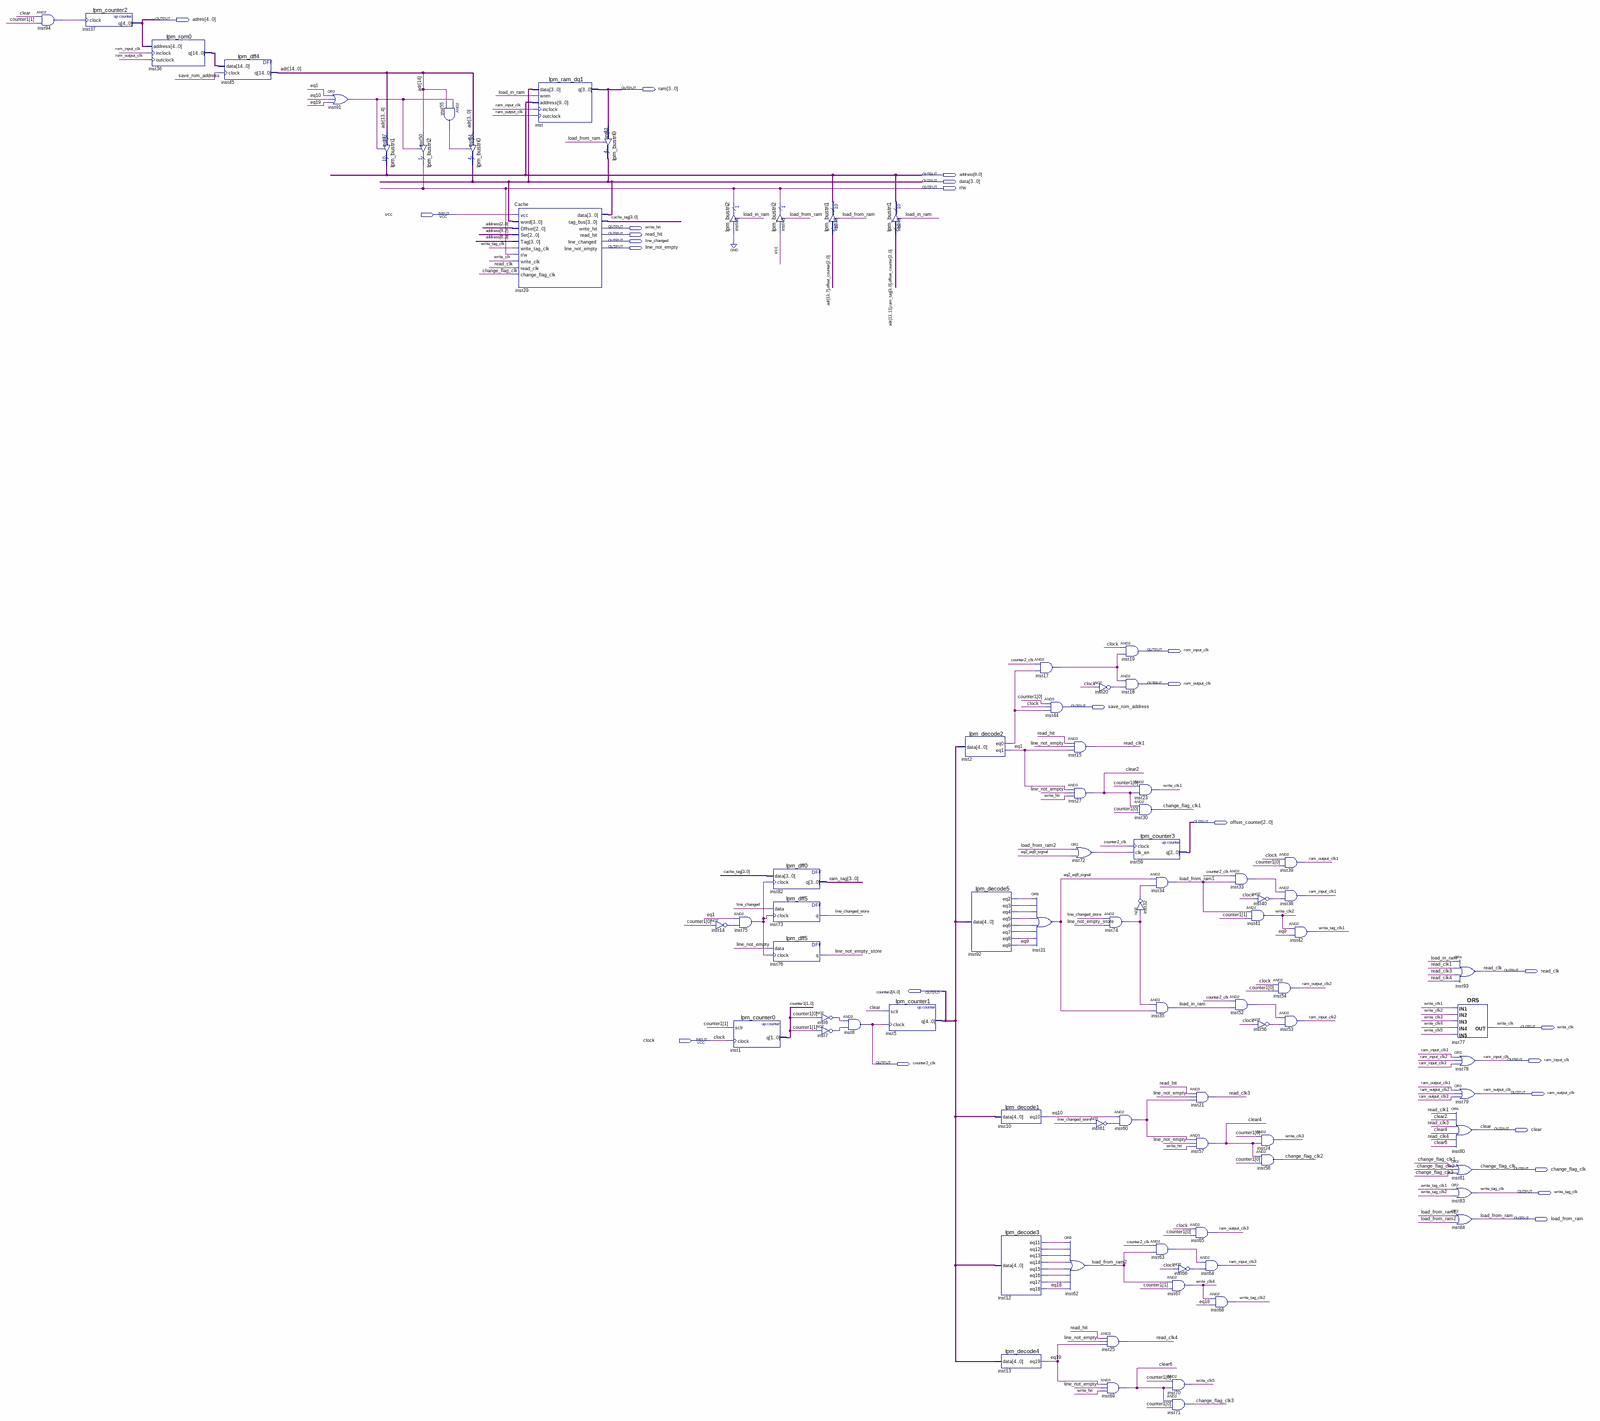
[diagram p0: schematic sheet, whole]
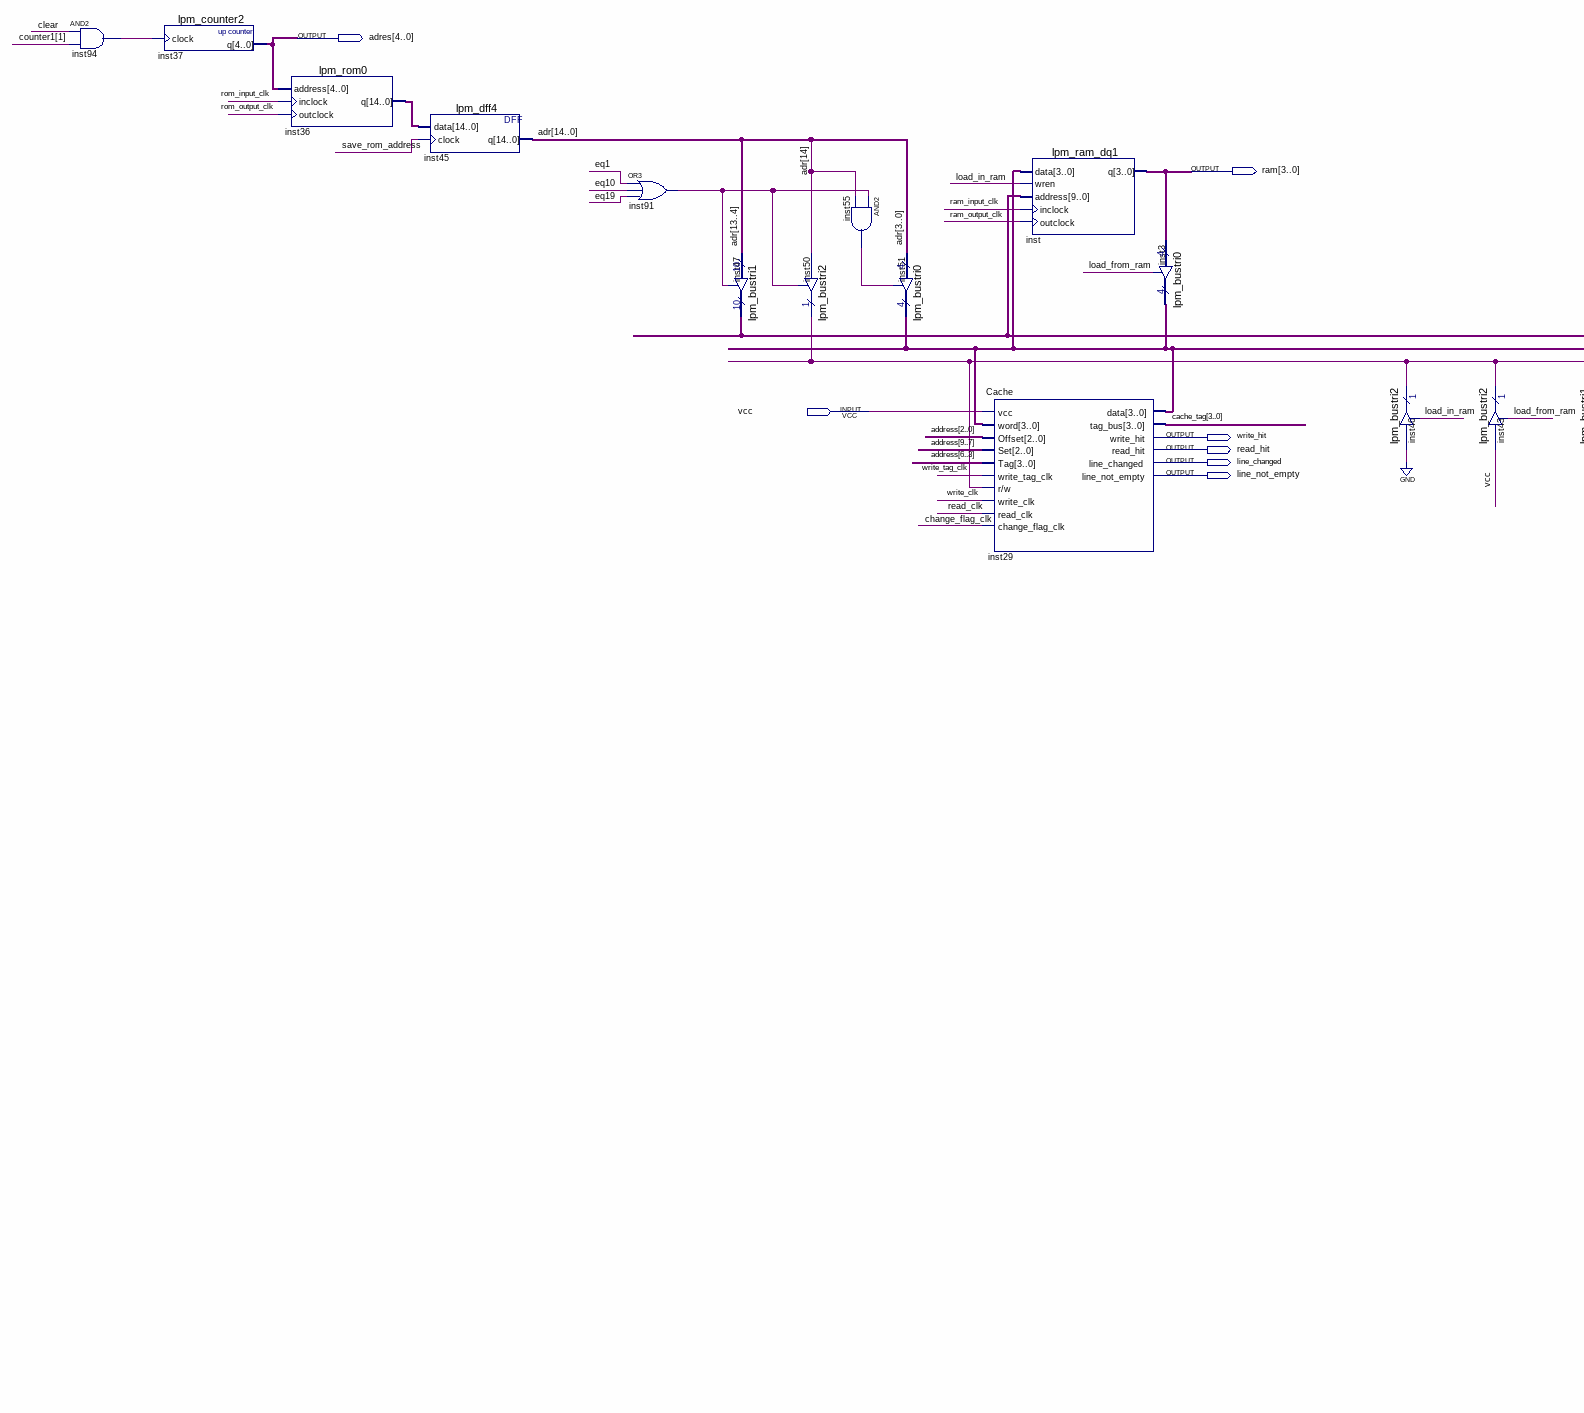
[diagram p1: schematic sheet, upper left part]
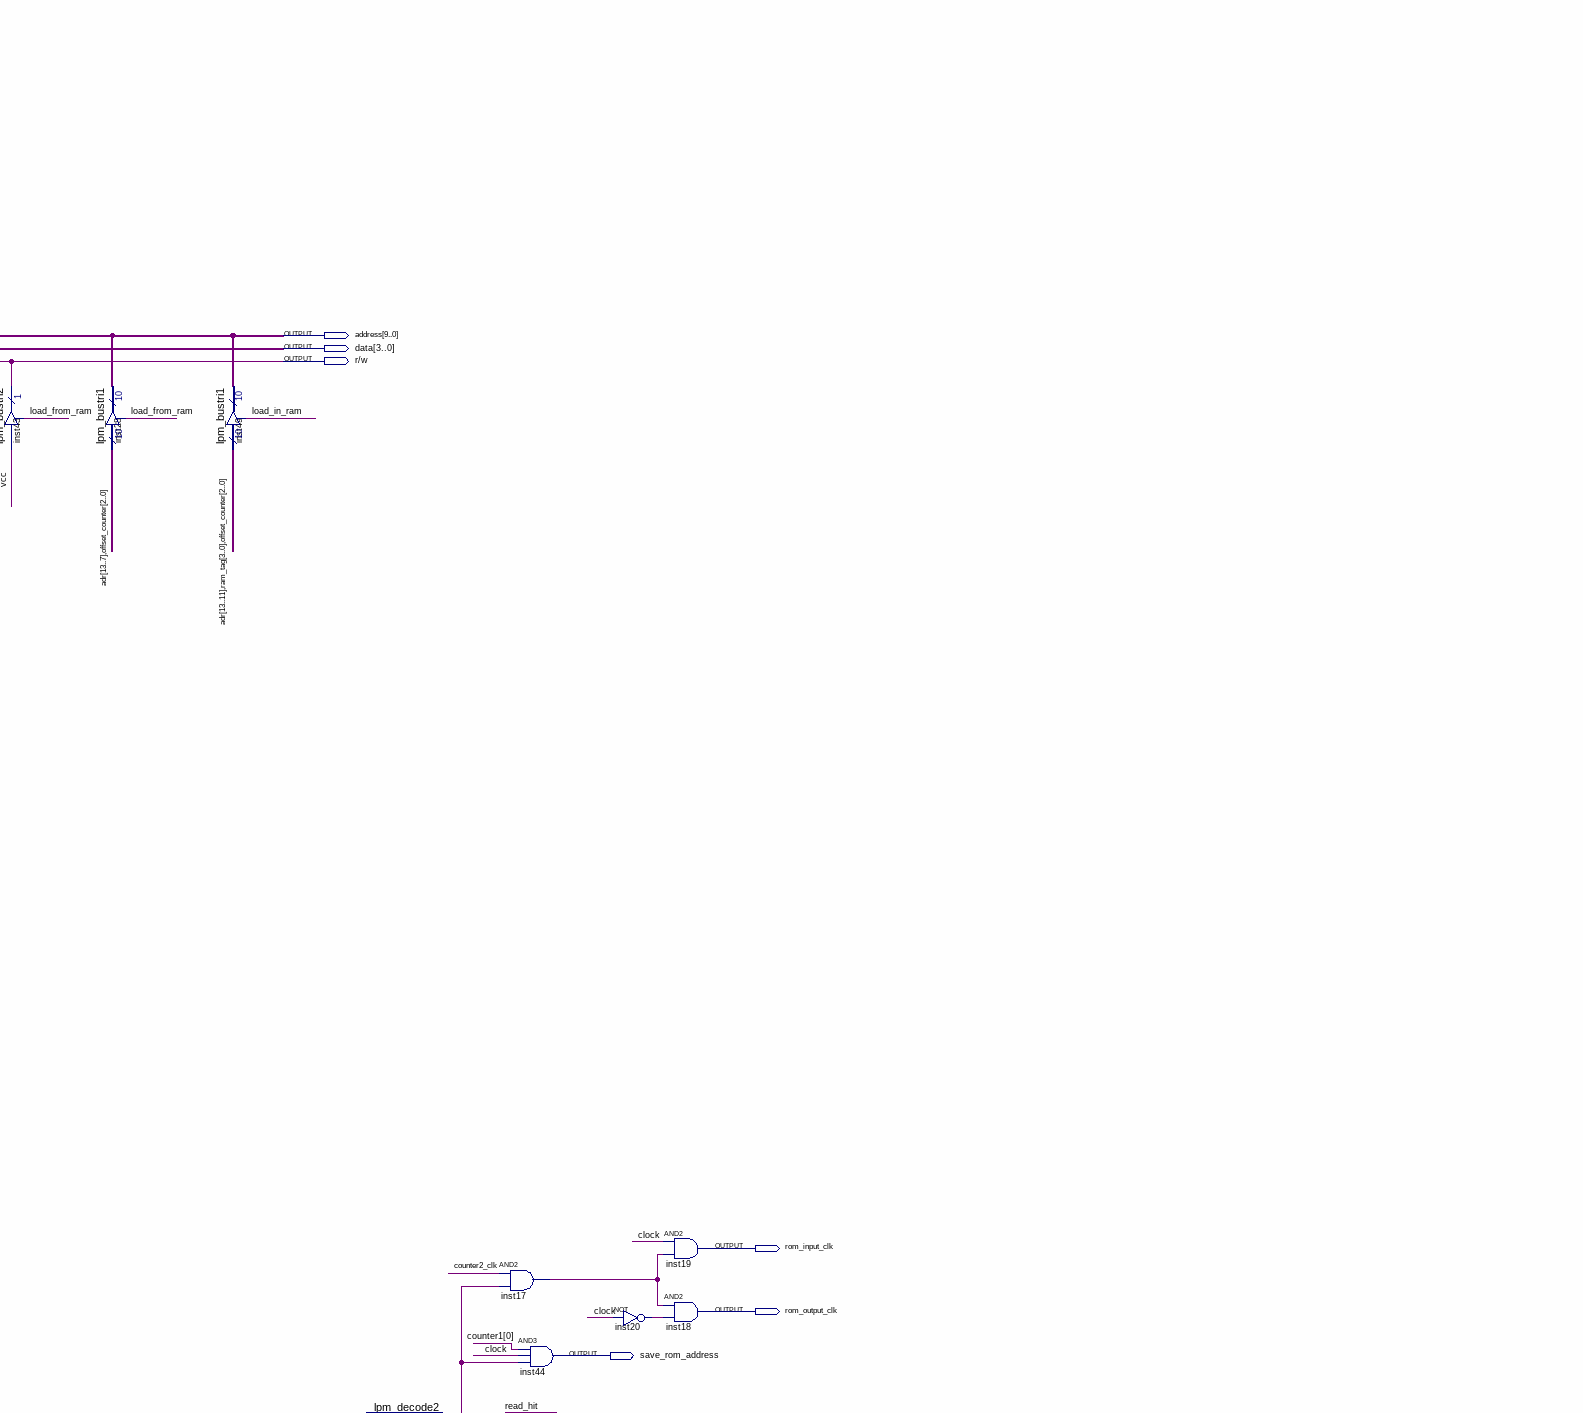
[diagram p2: schematic sheet, upper right part]
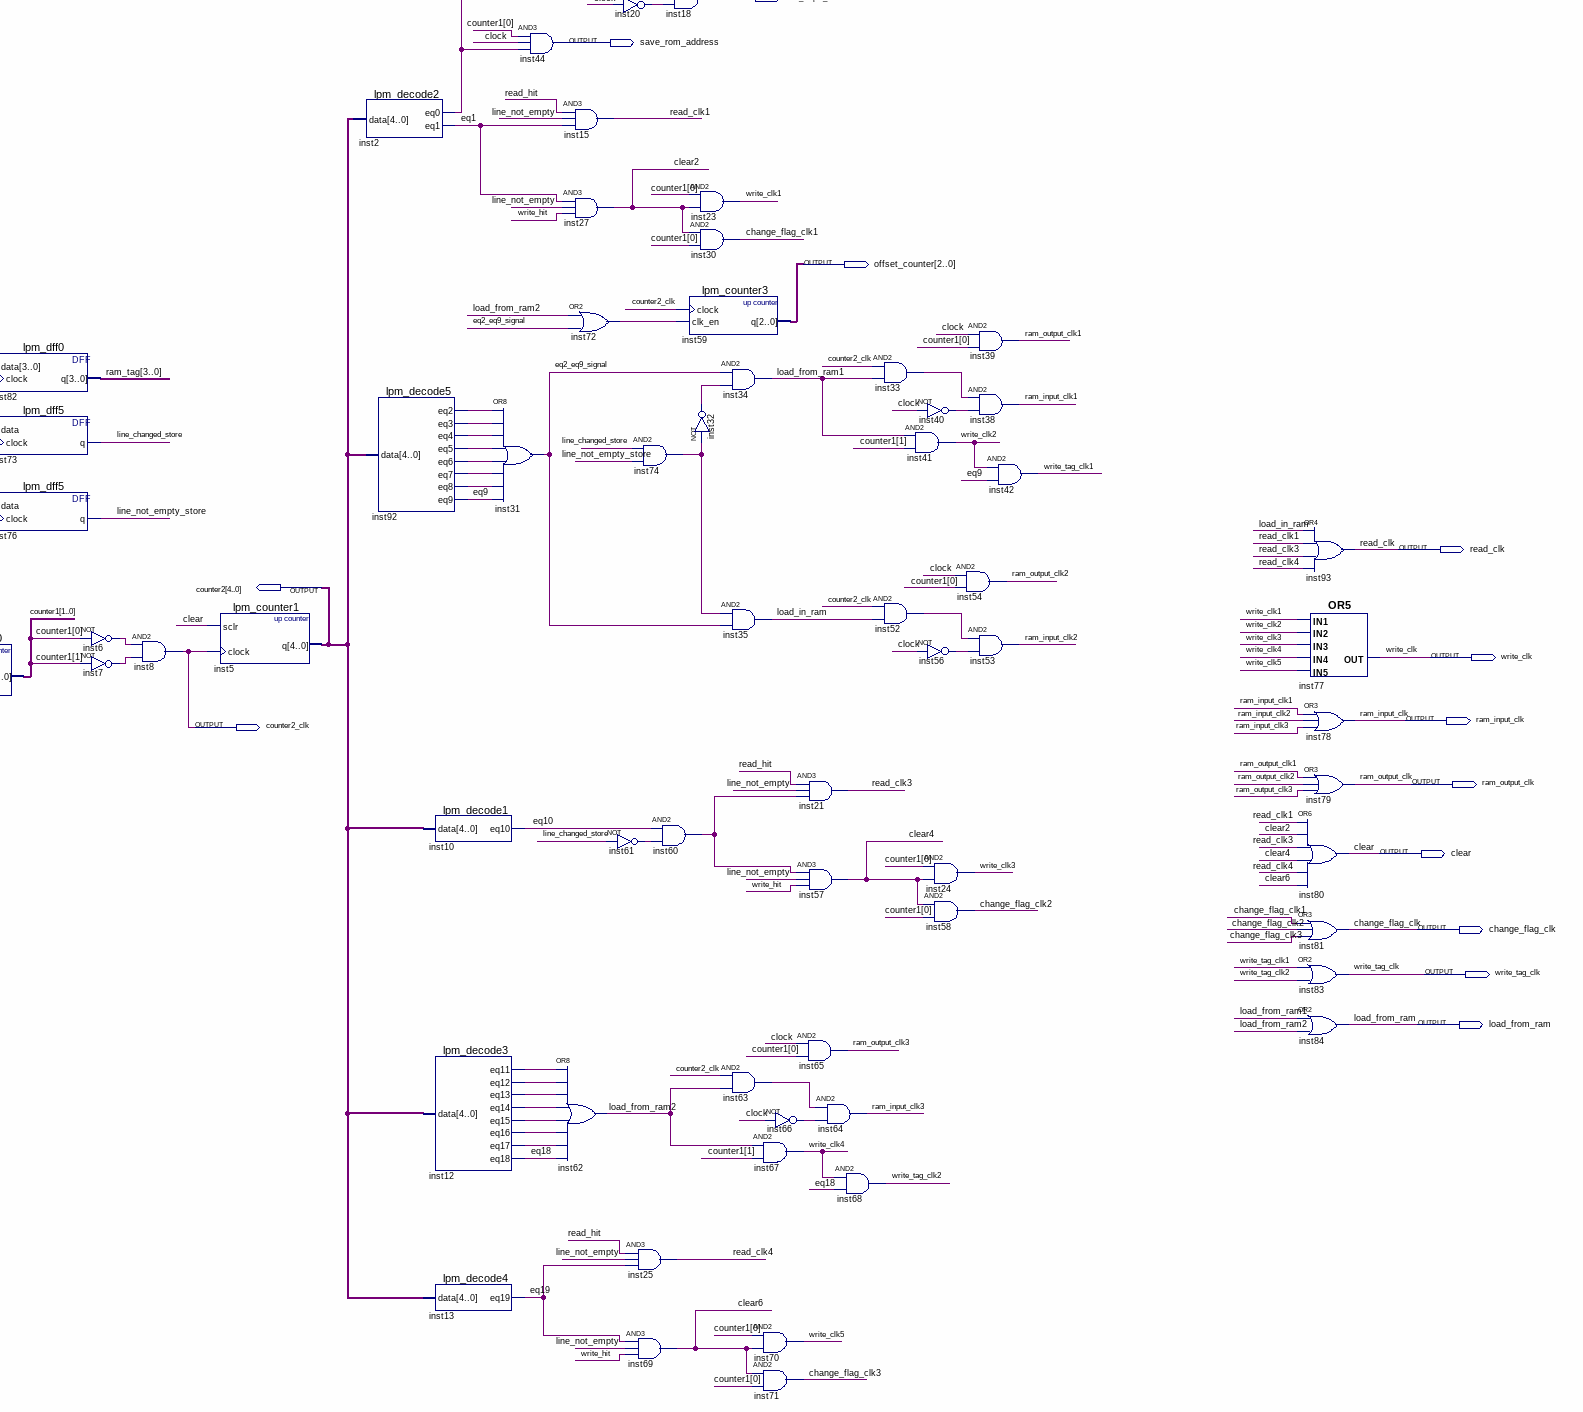
[diagram p3: schematic sheet, lower right part]
// Quartus schematic test.bdf as structural Verilog: 82 symbols, 25 pins
module test (
  input  vcc,
  input  clock,
  output [4:0] adres,
  output [3:0] ram,
  output [9:0] address,
  output [3:0] data,
  output \r/w ,
  output write_hit,
  output read_hit,
  output line_changed,
  output line_not_empty,
  output rom_input_clk,
  output rom_output_clk,
  output save_rom_address,
  output [2:0] offset_counter,
  output read_clk,
  output [4:0] counter2,
  output write_clk,
  output ram_input_clk,
  output counter2_clk,
  output ram_output_clk,
  output clear,
  output change_flag_clk,
  output write_tag_clk,
  output load_from_ram
);

  wire change_flag_clk1, change_flag_clk2, change_flag_clk3, clear2, clear4, clear6, eq1, eq2_eq9_signal,
       eq9, eq10, eq18, eq19, inst2_eq0, inst6_out, inst7_out, inst12_eq11, inst12_eq12, inst12_eq13,
       inst12_eq14, inst12_eq15, inst12_eq16, inst12_eq17, inst14_out, inst17_out, inst20_out, inst32_out,
       inst33_out, inst40_out, inst52_out, inst55_out, inst56_out, inst60_out, inst61_out, inst63_out,
       inst66_out, inst72_out, inst74_out, inst75_out, inst91_out, inst92_eq2, inst92_eq3, inst92_eq4,
       inst92_eq5, inst92_eq6, inst92_eq7, inst92_eq8, inst94_out, line_changed_store, line_not_empty_store,
       load_from_ram1, load_from_ram2, load_in_ram, ram_input_clk1, ram_input_clk2, ram_input_clk3,
       ram_output_clk1, ram_output_clk2, ram_output_clk3, read_clk1, read_clk3, read_clk4, write_clk1,
       write_clk2, write_clk3, write_clk4, write_clk5, write_tag_clk1, write_tag_clk2;
  wire [1:0] counter1;
  wire [3:0] cache_tag, ram_tag;
  wire [14:0] adr, inst36_q;

  and inst94 (inst94_out, clear, counter1[1]);
  lpm_counter2 inst37 (.clock(inst94_out), .q(adres));
  lpm_rom0 inst36 (.address(adres), .inclock(rom_input_clk), .outclock(rom_output_clk), .q(inst36_q));
  lpm_dff4 inst45 (.data(inst36_q), .clock(save_rom_address), .q(adr));
  or inst91 (inst91_out, eq1, eq10, eq19);
  lpm_bustri1 inst47 (.enabledt(inst91_out), .data(adr[13:4]), .tridata(address));
  lpm_bustri2 inst50 (.enabledt(inst91_out), .data(adr[14]), .tridata(\r/w ));
  and inst55 (inst55_out, inst91_out, adr[14]);
  lpm_bustri0 inst51 (.enabledt(inst55_out), .data(adr[3:0]), .tridata(data));
  lpm_ram_dq1 inst (
    .data(data), .wren(load_in_ram), .address(address), .inclock(ram_input_clk), .outclock(ram_output_clk),
    .q(ram));
  Cache inst29 (
    .vcc(vcc), .word(data), .Offset(address[2:0]), .Set(address[9:7]), .Tag(address[6:3]),
    .write_tag_clk(write_tag_clk), .\r/w (\r/w ), .write_clk(write_clk), .read_clk(read_clk),
    .change_flag_clk(change_flag_clk), .data(data), .tag_bus(cache_tag), .write_hit(write_hit),
    .read_hit(read_hit), .line_changed(line_changed), .line_not_empty(line_not_empty));
  lpm_bustri0 inst3 (.enabledt(load_from_ram), .data(ram), .tridata(data));
  not inst14 (inst14_out, counter1[0]);
  lpm_bustri2 inst46 (.enabledt(load_in_ram), .data(1'b0), .tridata(\r/w ));
  and inst75 (inst75_out, eq1, inst14_out);
  lpm_counter0 inst1 (.sclr(counter1[1]), .clock(clock), .q(counter1));
  lpm_bustri2 inst43 (.enabledt(load_from_ram), .data(vcc), .tridata(\r/w ));
  lpm_dff0 inst82 (.data(cache_tag), .clock(inst75_out), .q(ram_tag));
  lpm_dff5 inst73 (.data(line_changed), .clock(inst75_out), .q(line_changed_store));
  lpm_dff5 inst76 (.data(line_not_empty), .clock(inst75_out), .q(line_not_empty_store));
  lpm_bustri1 inst28 (.enabledt(load_from_ram), .data({adr[13:7], offset_counter}), .tridata(address));
  not inst6 (inst6_out, counter1[0]);
  not inst7 (inst7_out, counter1[1]);
  and inst8 (counter2_clk, inst6_out, inst7_out);
  lpm_bustri1 inst49 (.enabledt(load_in_ram), .data({adr[13:11], ram_tag, offset_counter}), .tridata(address));
  lpm_counter1 inst5 (.sclr(clear), .clock(counter2_clk), .q(counter2));
  lpm_decode2 inst2 (.data(counter2), .eq0(inst2_eq0), .eq1(eq1));
  lpm_decode5 inst92 (
    .data(counter2), .eq2(inst92_eq2), .eq3(inst92_eq3), .eq4(inst92_eq4), .eq5(inst92_eq5),
    .eq6(inst92_eq6), .eq7(inst92_eq7), .eq8(inst92_eq8), .eq9(eq9));
  lpm_decode1 inst10 (.data(counter2), .eq10(eq10));
  lpm_decode3 inst12 (
    .data(counter2), .eq11(inst12_eq11), .eq12(inst12_eq12), .eq13(inst12_eq13), .eq14(inst12_eq14),
    .eq15(inst12_eq15), .eq16(inst12_eq16), .eq17(inst12_eq17), .eq18(eq18));
  lpm_decode4 inst13 (.data(counter2), .eq19(eq19));
  and inst17 (inst17_out, counter2_clk, inst2_eq0);
  or inst31 (eq2_eq9_signal, inst92_eq2, inst92_eq3, inst92_eq4, inst92_eq5, inst92_eq6, inst92_eq7, inst92_eq8, eq9);
  and inst44 (save_rom_address, counter1[0], clock, inst2_eq0);
  or inst62 (load_from_ram2, inst12_eq11, inst12_eq12, inst12_eq13, inst12_eq14, inst12_eq15, inst12_eq16, inst12_eq17, eq18);
  and inst15 (read_clk1, read_hit, line_not_empty, eq1);
  and inst27 (clear2, eq1, line_not_empty, write_hit);
  or inst72 (inst72_out, load_from_ram2, eq2_eq9_signal);
  not inst61 (inst61_out, line_changed_store);
  not inst20 (inst20_out, clock);
  and inst74 (inst74_out, line_changed_store, line_not_empty_store);
  and inst60 (inst60_out, eq10, inst61_out);
  and inst25 (read_clk4, read_hit, line_not_empty, eq19);
  and inst69 (clear6, eq19, line_not_empty, write_hit);
  and inst19 (rom_input_clk, clock, inst17_out);
  and inst18 (rom_output_clk, inst17_out, inst20_out);
  and inst23 (write_clk1, counter1[0], clear2);
  and inst30 (change_flag_clk1, clear2, counter1[0]);
  lpm_counter3 inst59 (.clock(counter2_clk), .clk_en(inst72_out), .q(offset_counter));
  not inst32 (inst32_out, inst74_out);
  and inst34 (load_from_ram1, eq2_eq9_signal, inst32_out);
  and inst35 (load_in_ram, inst74_out, eq2_eq9_signal);
  and inst63 (inst63_out, counter2_clk, load_from_ram2);
  and inst67 (write_clk4, load_from_ram2, counter1[1]);
  and inst70 (write_clk5, counter1[0], clear6);
  and inst71 (change_flag_clk3, clear6, counter1[0]);
  and inst21 (read_clk3, read_hit, line_not_empty, inst60_out);
  and inst57 (clear4, inst60_out, line_not_empty, write_hit);
  and inst65 (ram_output_clk3, clock, counter1[0]);
  not inst66 (inst66_out, clock);
  and inst64 (ram_input_clk3, inst63_out, inst66_out);
  and inst68 (write_tag_clk2, write_clk4, eq18);
  and inst33 (inst33_out, counter2_clk, load_from_ram1);
  and inst41 (write_clk2, load_from_ram1, counter1[1]);
  and inst52 (inst52_out, counter2_clk, load_in_ram);
  not inst40 (inst40_out, clock);
  and inst54 (ram_output_clk2, clock, counter1[0]);
  not inst56 (inst56_out, clock);
  and inst24 (write_clk3, counter1[0], clear4);
  and inst58 (change_flag_clk2, clear4, counter1[0]);
  and inst39 (ram_output_clk1, clock, counter1[0]);
  and inst38 (ram_input_clk1, inst33_out, inst40_out);
  and inst42 (write_tag_clk1, write_clk2, eq9);
  and inst53 (ram_input_clk2, inst52_out, inst56_out);
  or inst93 (read_clk, load_in_ram, read_clk1, read_clk3, read_clk4);
  or inst77 (write_clk, write_clk1, write_clk2, write_clk3, write_clk4, write_clk5);
  or inst78 (ram_input_clk, ram_input_clk1, ram_input_clk2, ram_input_clk3);
  or inst79 (ram_output_clk, ram_output_clk1, ram_output_clk2, ram_output_clk3);
  or inst80 (clear, read_clk1, clear2, read_clk3, clear4, read_clk4, clear6);
  or inst81 (change_flag_clk, change_flag_clk1, change_flag_clk2, change_flag_clk3);
  or inst83 (write_tag_clk, write_tag_clk1, write_tag_clk2);
  or inst84 (load_from_ram, load_from_ram1, load_from_ram2);
endmodule
